# EAGLE design GasSensorCentral_v1.1 (EAGLE 7.2.0)
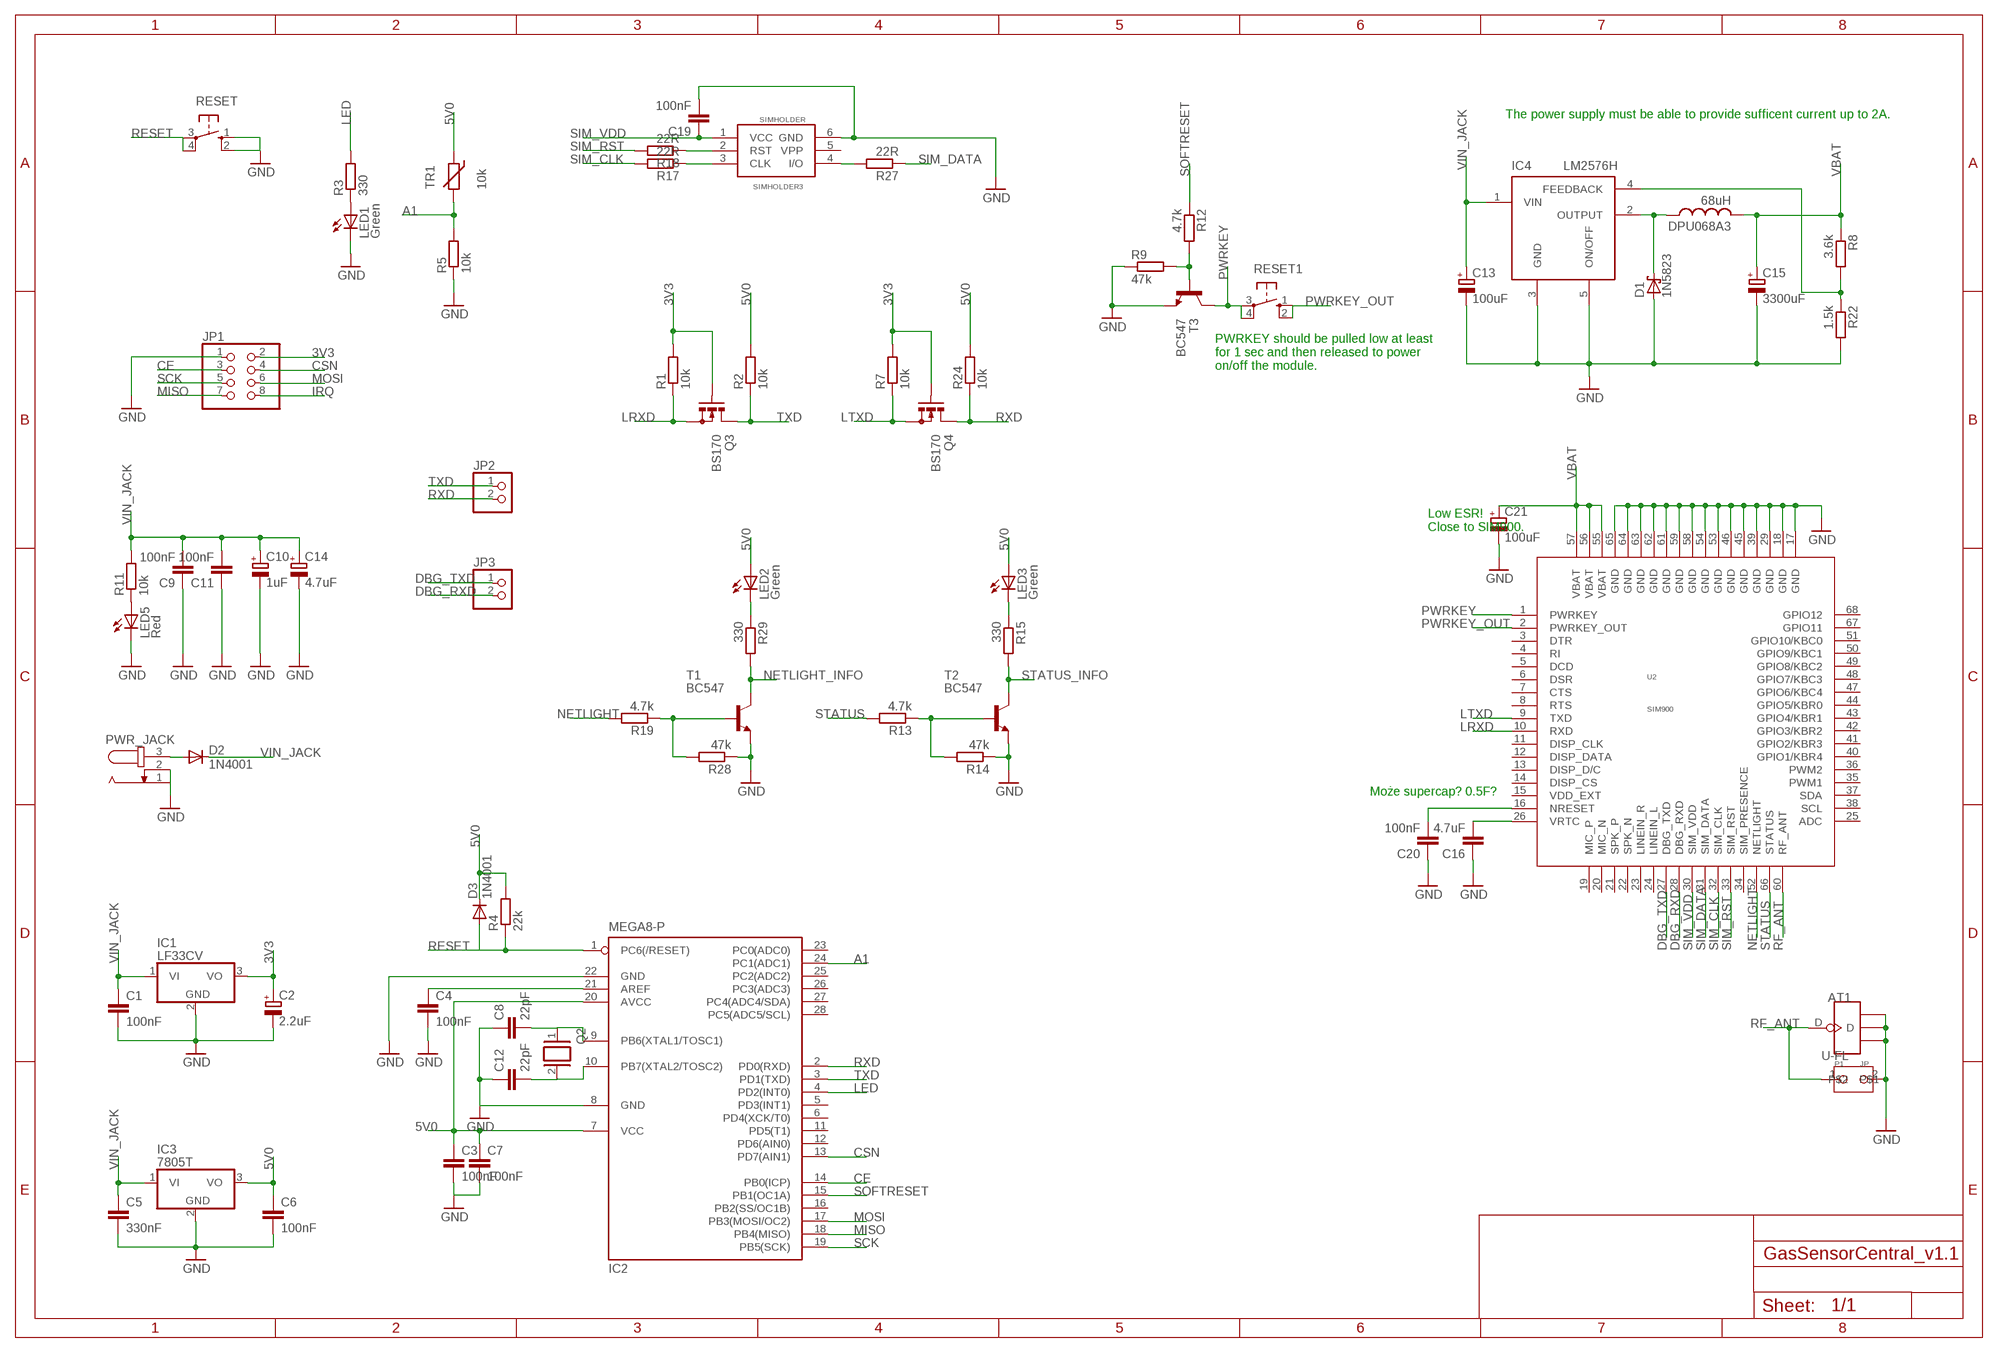
[diagram p0: schematic, sheet 1]

## Parts
AT1  U-FL  ANTENNA-U-FL  [4P-U-FL]
C1  100nF  C-EU025-025X050  [C025-025X050]
C2  2.2uF  CPOL-EUE2.5-5  [E2,5-5]
C3  100nF  C-EU025-025X050  [C025-025X050]
C4  100nF  C-EU025-025X050  [C025-025X050]
C5  330nF  C-EU025-025X050  [C025-025X050]
C6  100nF  C-EU025-025X050  [C025-025X050]
C7  100nF  C-EU025-025X050  [C025-025X050]
C8  22pF  C-EU025-025X050  [C025-025X050]
C9  100nF  C-EU025-025X050  [C025-025X050]
C10  1uF  CPOL-EUE2.5-5  [E2,5-5]
C11  100nF  C-EU025-025X050  [C025-025X050]
C12  22pF  C-EU025-025X050  [C025-025X050]
C13  100uF  CPOL-EUE2.5-5  [E2,5-5]
C14  4.7uF  CPOL-EUE2.5-5  [E2,5-5]
C15  3300uF  CPOL-EUE3.5-10  [E3,5-10]
C16  4.7uF  C-EU025-025X050  [C025-025X050]
C19  100nF  C-EU025-025X050  [C025-025X050]
C20  100nF  C-EU025-025X050  [C025-025X050]
C21  100uF  CPOL-EUE2.5-5  [E2,5-5]
D1  1N5823  1N5817-B  [DO41-7.6]
D2  1N4001  1N4004  [DO41-10]
D3  1N4001  1N4004  [DO41-10]
DPU068A3  68uH  L-USTJ3-U1  [TJ3-U1]
IC1  LF33CV  7805T  [TO220H]
IC2  MEGA8-P  [DIL28-3]
IC3  7805T  [TO220H]
IC4  LM2576H  [TO220-52]
JP1  PINHD-2X4  [2X04]
JP2  PINHD-1X2  [1X02]
JP3  PINHD-1X2  [1X02]
LED1  Green  LED3MM  [LED3MM]
LED2  Green  LED3MM  [LED3MM]
LED3  Green  LED3MM  [LED3MM]
LED5  Red  LED3MM  [LED3MM]
P1  JP  [JP]
PWR_JACK  JACK-PLUG0  [SPC4077]
Q2  XTAL/S  [QS]
Q3  BS170  [SOT54E]
Q4  BS170  [SOT54E]
R1  10k  R-EU_0207/10  [0207/10]
R2  10k  R-EU_0207/10  [0207/10]
R3  330  R-EU_0207/10  [0207/10]
R4  22k  R-EU_0207/10  [0207/10]
R5  10k  R-EU_0207/10  [0207/10]
R7  10k  R-EU_0207/10  [0207/10]
R8  3.6k  R-EU_0207/10  [0207/10]
R9  47k  R-EU_0207/10  [0207/10]
R11  10k  R-EU_0207/10  [0207/10]
R12  4.7k  R-EU_0207/10  [0207/10]
R13  4.7k  R-EU_0207/10  [0207/10]
R14  47k  R-EU_0207/10  [0207/10]
R15  330  R-EU_0207/10  [0207/10]
R17  22R  R-EU_0207/10  [0207/10]
R18  22R  R-EU_0207/10  [0207/10]
R19  4.7k  R-EU_0207/10  [0207/10]
R22  1.5k  R-EU_0207/10  [0207/10]
R24  10k  R-EU_0207/10  [0207/10]
R27  22R  R-EU_0207/10  [0207/10]
R28  47k  R-EU_0207/10  [0207/10]
R29  330  R-EU_0207/10  [0207/10]
RESET  10-XX  [B3F-10XX]
RESET1  10-XX  [B3F-10XX]
SIMHOLDER  SIMHOLDER3  [SIMHOLDER3]
T1  BC547  [TO92]
T2  BC547  [TO92]
T3  BC547  [TO92]
TR1  10k  THERMISTOR_R-2,5  [RS-2,5]
U2  SIM900  [SIM900]

## Nets
3V3: C2.+ IC1.3(VO) JP1.2 Q3.G Q4.G R1.2 R7.2
5V0: C3.1 C6.1 C7.1 D3.C IC2.7(VCC) IC2.20(AVCC) IC3.3(VO) LED2.A LED3.A R2.2 R4.2 R24.2 TR1.1
A1: IC2.24(PC1(ADC1)) R5.2 TR1.2
CE: IC2.14(PB0(ICP)) JP1.3
CSN: IC2.13(PD7(AIN1)) JP1.4
DBG_RXD: JP3.2 U2.28(DBG_RXD)
DBG_TXD: JP3.1 U2.27(DBG_TXD)
GND: AT1.GND1 AT1.GND2 AT1.GND3 C1.2 C2.- C3.2 C4.2 C5.2 C6.2 C7.2 C8.1 C9.1 C10.- C11.1 C12.1 C13.- C14.- C15.- C16.1 C19.2 C20.1 C21.- D1.A IC1.2(GND) IC2.8(GND) IC2.22(GND) IC3.2(GND) IC4.3(GND) IC4.5(ON/OFF) JP1.1 LED1.K(C) LED5.K(C) P1.2 PWR_JACK.1 PWR_JACK.2 R5.1 R9.1 R14.1 R22.2 R28.1 RESET.1(S) RESET.2(S1) SIMHOLDER.6(GND) T1.1(E) T2.1(E) T3.1(E) U2.17(GND) U2.18(GND) U2.29(GND) U2.39(GND) U2.45(GND) U2.46(GND) U2.53(GND) U2.54(GND) U2.58(GND) U2.59(GND) U2.61(GND) U2.62(GND) U2.63(GND) U2.64(GND) U2.65(GND)
IRQ: JP1.8
LED: IC2.4(PD2(INT0)) R3.2
LRXD: Q3.S R1.1 U2.10(RXD)
LTXD: Q4.S R7.1 U2.9(TXD)
MISO: IC2.18(PB4(MISO)) JP1.7
MOSI: IC2.17(PB3(MOSI/OC2)) JP1.6
N$1: C4.1 IC2.21(AREF)
N$3: IC4.4(FEEDBACK) R8.2 R22.1
N$4: D2.A PWR_JACK.3
N$5: LED1.A R3.1
N$6: R27.2 SIMHOLDER.4(I/O)
N$7: LED2.K(C) R29.1
N$9: R13.1 R14.2 T2.2(B)
N$10: LED5.A R11.1
N$11: LED3.K(C) R15.1
N$12: D1.C DPU068A3.1 IC4.2(OUTPUT)
N$13: C20.2 U2.16(NRESET)
N$14: R9.2 R12.2 T3.2(B)
N$15: R19.1 R28.2 T1.2(B)
N$17: C16.2 U2.26(VRTC)
N$24: R18.1 SIMHOLDER.2(RST)
N$25: R17.1 SIMHOLDER.3(CLK)
N$29: C8.2 IC2.9(PB6(XTAL1/TOSC1)) Q2.1
N$35: C12.2 IC2.10(PB7(XTAL2/TOSC2)) Q2.2
NETLIGHT: R19.2 U2.52(NETLIGHT)
NETLIGHT_INFO: R29.2 T1.3(C)
PWRKEY: RESET1.3(P) RESET1.4(P1) T3.3(C) U2.1(PWRKEY)
PWRKEY_OUT: RESET1.1(S) RESET1.2(S1) U2.2(PWRKEY_OUT)
RESET: D3.A IC2.1(PC6(/RESET)) R4.1 RESET.3(P) RESET.4(P1)
RF_ANT: AT1.D P1.1 U2.60(RF_ANT)
RXD: IC2.2(PD0(RXD)) JP2.2 Q4.D R24.1
SCK: IC2.19(PB5(SCK)) JP1.5
SIM_CLK: R17.2 U2.32(SIM_CLK)
SIM_DATA: R27.1 U2.31(SIM_DATA)
SIM_RST: R18.2 U2.33(SIM_RST)
SIM_VDD: C19.1 SIMHOLDER.1(VCC) U2.30(SIM_VDD)
SOFTRESET: IC2.15(PB1(OC1A)) R12.1
STATUS: R13.2 U2.66(STATUS)
STATUS_INFO: R15.2 T2.3(C)
TXD: IC2.3(PD1(TXD)) JP2.1 Q3.D R2.1
VBAT: C15.+ C21.+ DPU068A3.2 R8.1 U2.55(VBAT) U2.56(VBAT) U2.57(VBAT)
VIN_JACK: C1.1 C5.1 C9.2 C10.+ C11.2 C13.+ C14.+ D2.C IC1.1(VI) IC3.1(VI) IC4.1(VIN) R11.2
Unconnected: IC2.5(PD3(INT1)) IC2.6(PD4(XCK/T0)) IC2.11(PD5(T1)) IC2.12(PD6(AIN0)) IC2.16(PB2(SS/OC1B)) IC2.23(PC0(ADC0)) IC2.25(PC2(ADC2)) IC2.26(PC3(ADC3)) IC2.27(PC4(ADC4/SDA)) IC2.28(PC5(ADC5/SCL)) SIMHOLDER.5(VPP) U2.3(DTR) U2.4(RI) U2.5(DCD) U2.6(DSR) U2.7(CTS) U2.8(RTS) U2.11(DISP_CLK) U2.12(DISP_DATA) U2.13(DISP_D/C) U2.14(DISP_CS) U2.15(VDD_EXT) U2.19(MIC_P) U2.20(MIC_N) U2.21(SPK_P) U2.22(SPK_N) U2.23(LINEIN_R) U2.24(LINEIN_L) U2.25(ADC) U2.34(SIM_PRESENCE) U2.35(PWM1) U2.36(PWM2) U2.37(SDA) U2.38(SCL) U2.40(GPIO1/KBR4) U2.41(GPIO2/KBR3) U2.42(GPIO3/KBR2) U2.43(GPIO4/KBR1) U2.44(GPIO5/KBR0) U2.47(GPIO6/KBC4) U2.48(GPIO7/KBC3) U2.49(GPIO8/KBC2) U2.50(GPIO9/KBC1) U2.51(GPIO10/KBC0) U2.67(GPIO11) U2.68(GPIO12)

## Notes on the sheet
- The power supply must be able to provide sufficent current up to 2A.
- PWRKEY should be pulled low at least 
  for 1 sec and then released to power 
  on/off the module.
- Low ESR!
  Close to SIM900.
- Może supercap? 0.5F?

## Library data of the parts
AT1 = Connector:ANTENNA-U-FL
C1 C3-C9 C11 C12 C16 C19 C20 = rcl:C-EU: CAPACITOR, European symbol
C2 C10 C13-C15 C21 = rcl:CPOL-EU: POLARIZED CAPACITOR, European symbol
D1 = diode:1N581*: 1.0A SCHOTTKY BARRIER RECTIFIER Source: http://www.diodes.com/datasheets/ds23001.pdf
D2 D3 = diode:1N4004: DIODE general purpose rectifier, 1 A
DPU068A3 = rcl:L-US: INDUCTOR, American symbol
IC1 IC3 = linear:78*: Positive VOLTAGE REGULATOR Source: http://cache.national.com/ds/LM/LM78L05.pdf http://www.fairchildsemi.com/ds/LM/LM7805.pdf
IC2 = atmel:MEGA8-P: MICROCONTROLLER 8 Kbytes FLASH, 1 kbytes SRAM, 512 bytes EEPROM, USART, 4-channel 10 bit ADC, 2-channel 8 bit ADC Pin compatible with Atmega48, ATMega88, ATMega168 Source: avr.lbr; OC_FARNELL: unknown; OC_NEWARK: unknown
IC4 = hosho:LM2576H
JP1 = pinhead:PINHD-2X4: PIN HEADER
JP2 JP3 = pinhead:PINHD-1X2: PIN HEADER
LED1-LED3 LED5 = led:LED: LED OSRAM: - CHIPLED LG R971, LG N971, LY N971, LG Q971, LY Q971, LO R971, LY R971 LH N974, LH R974 LS Q976, LO Q976, LY Q976 LO Q996 - Hyper CHIPLED LW Q18S LB Q993, LB Q99A, LB R99A - SideLED LS A670, LO A670, LY A670, LG A670, LP A670 LB A673, LV A673, LT A673, LW A673 LH A674 LY A675 LS A676, LA A676, LO A676, LY A676, LW A676 LS A679, LY A679, LG A679 - Hyper Micro SIDELED® LS Y876, LA Y876, LO Y876, LY Y876 LT Y87S - SmartLED LW L88C, LW L88S LB L89C, LB L89S, LG L890 LS L89K, LO L89K, LY L89K LS L896, LA L896, LO L896, LY L896 - TOPLED LS T670, LO T670, LY T670, LG T670, LP T670 LSG T670, LSP T670, LSY T670, LOP T670, LYG T670 LG T671, LOG T671, LSG T671 LB T673, LV T673, LT T673, LW T673 LH T674 LS T676, LA T676, LO T676, LY T676, LB T676, LH T676, LSB T676, LW T676 LB T67C, LV T67C, LT T67C, LS T67K, LO T67K, LY T67K, LW E67C LS E67B, LA E67B, LO E67B, LY E67B, LB E67C, LV E67C, LT E67C LW T67C LS T679, LY T679, LG T679 LS T770, LO T770, LY T770, LG T770, LP T770 LB T773, LV T773, LT T773, LW T773 LH T774 LS E675, LA E675, LY E675, LS T675 LS T776, LA T776, LO T776, LY T776, LB T776 LHGB T686 LT T68C, LB T68C - Hyper Mini TOPLED® LB M676 - Mini TOPLED Santana® LG M470 LS M47K, LO M47K, LY M47K Source: http://www.osram.convergy.de LUXEON: - LUMILED® LXK2-PW12-R00, LXK2-PW12-S00, LXK2-PW14-U00, LXK2-PW14-V00 LXK2-PM12-R00, LXK2-PM12-S00, LXK2-PM14-U00 LXK2-PE12-Q00, LXK2-PE12-R00, LXK2-PE12-S00, LXK2-PE14-T00, LXK2-PE14-U00 LXK2-PB12-K00, LXK2-PB12-L00, LXK2-PB12-M00, LXK2-PB14-N00, LXK2-PB14-P00, LXK2-PB14-Q00 LXK2-PR12-L00, LXK2-PR12-M00, LXK2-PR14-Q00, LXK2-PR14-R00 LXK2-PD12-Q00, LXK2-PD12-R00, LXK2-PD12-S00 LXK2-PH12-R00, LXK2-PH12-S00 LXK2-PL12-P00, LXK2-PL12-Q00, LXK2-PL12-R00 Source: www.luxeon.com KINGBRIGHT: KA-3528ASYC Source: www.kingbright.com
P1 = mySeeed:JP
PWR_JACK = con-jack:JACK-PLUG: DC POWER JACK Power Jack, DC, Right Angle, Through Hole, Rated 5A at 16VDC, PC Terminals Distributor: Farnell (www.Farnell.de) Drawing: 84N1161.pdf / 84N1162.pdf Manufacturer: SPC Technology (www.spctechnology.com) Type: SPC4077 / SPC 4078; OC_FARNELL: unknown; OC_NEWARK: unknown
Q2 = special:XTAL/S: CRYSTAL
Q3 Q4 = transistor-small-signal:BS170: N-CHANNEL MOS FET
R1-R5 R7-R9 R11-R15 R17-R19 R22 R24 R27-R29 = rcl:R-EU_: RESISTOR, European symbol
RESET RESET1 = switch-omron:10-XX: OMRON SWITCH; MPN: B3F-1000; OC_FARNELL: 176432; OC_NEWARK: 36M3542
SIMHOLDER = SparkFun2:SIMHOLDER3
T1-T3 = transistor:BC547: NPN TRANSISTOR
TR1 = discrete:THERMISTOR_: Thermo Resistor
U2 = ICs_v54:SIM900

## Board
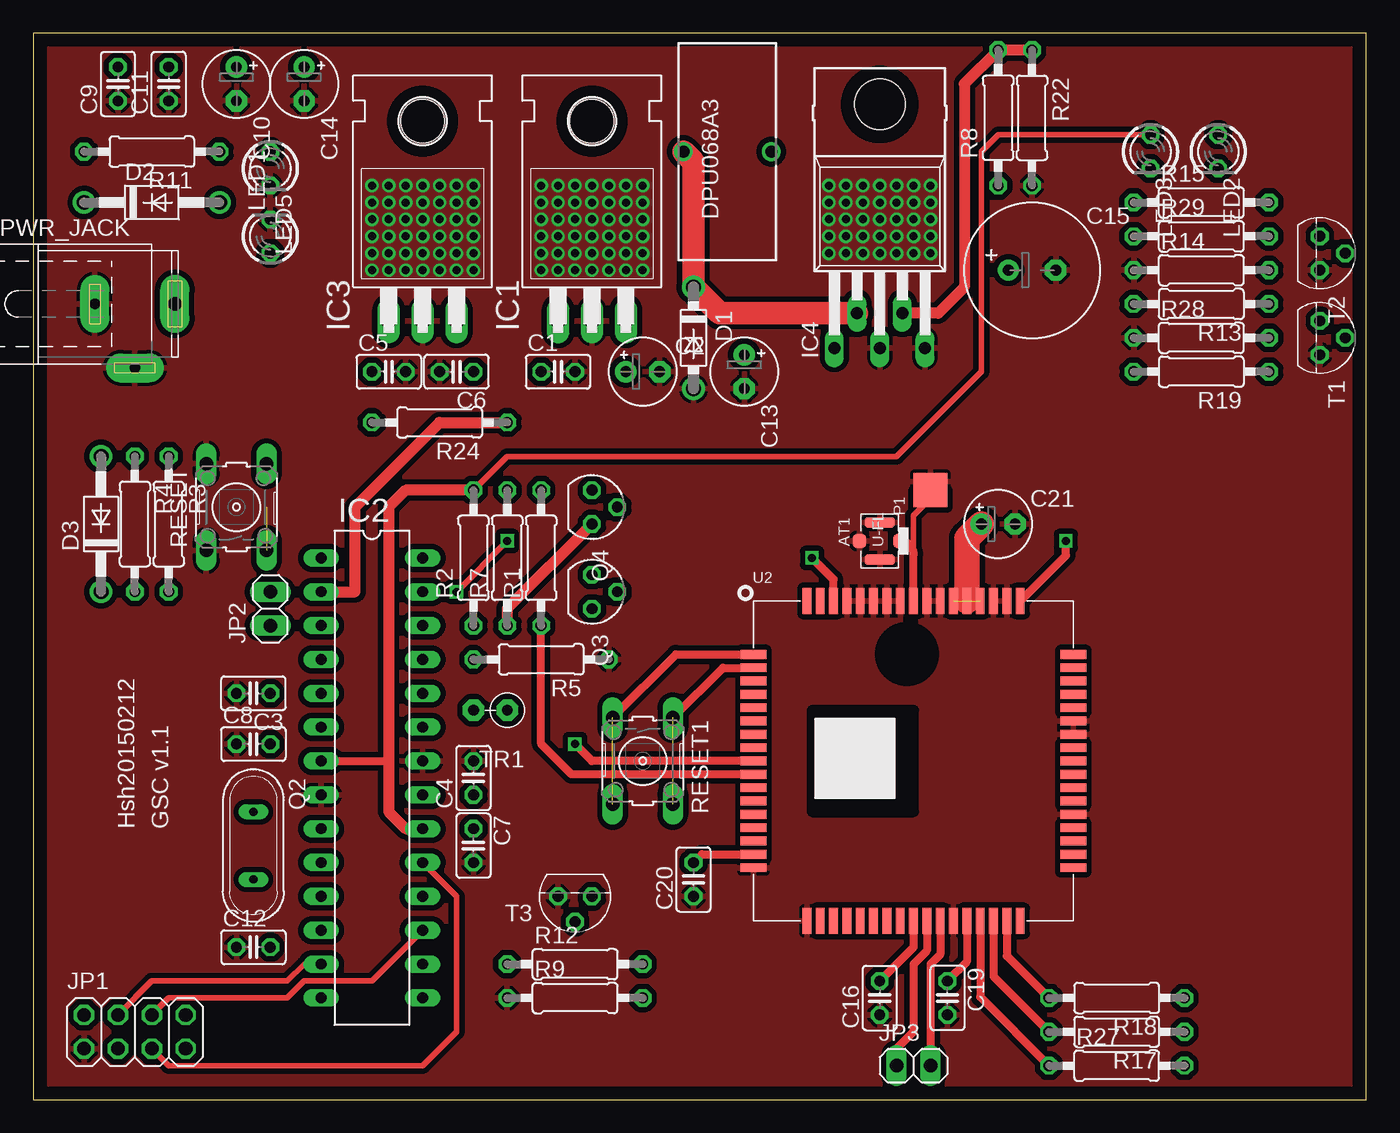
[diagram p1: board, top side]
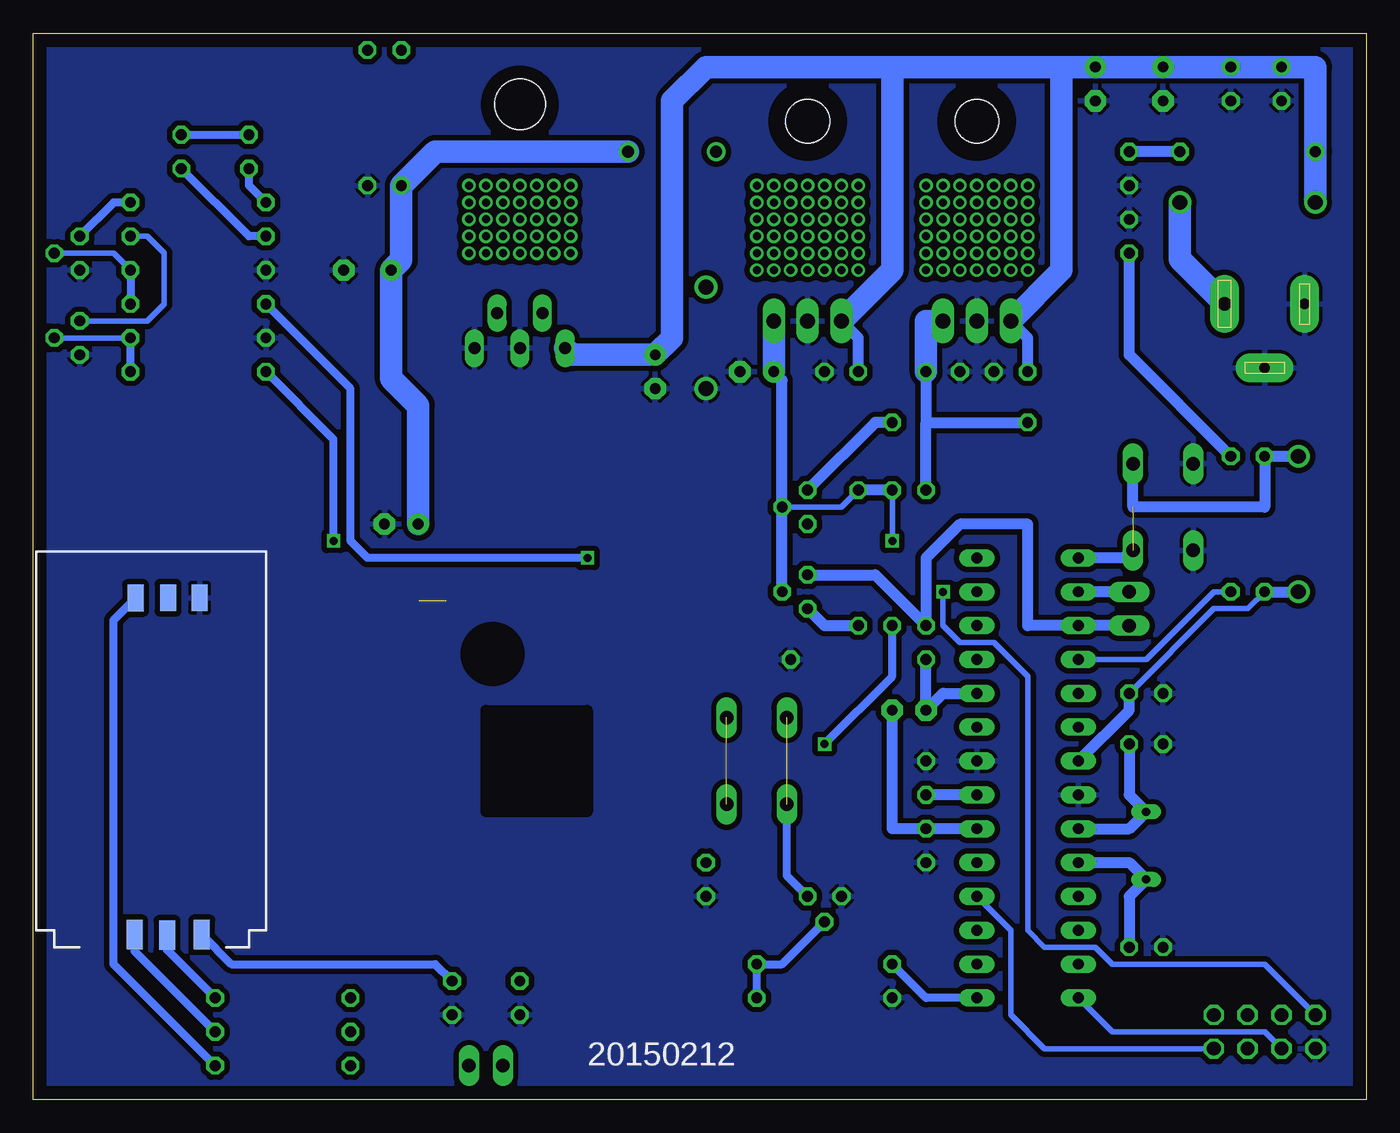
[diagram p2: board, bottom side, seen from below]

Size 100 x 80 mm. Coordinates in mm from the lower left corner, seen from the top.
Outline: 0,0 100,0 100,80 0,80 0,0
Copper layers (1*16): Top 0.035mm / dielectric 1.5mm / Bottom 0.035mm
Design rules "default": minimum track width 10mil, minimum drill 24mil, track to track 8mil, track to pad 8mil, pad to pad 8mil, via to via 8mil, smd to smd 8mil, copper to edge 40mil, drill to drill 8mil, minimum pad ring 10mil, minimum via ring 8mil, stop-mask expansion 4mil, vias tented up to drill 0mil, thermal gap 10mil
tRestrict: area 58.4,21.6 to 66,29.2; area 63.7,31.6 to 67.3,35.2
bRestrict: area 58.4,21.6 to 66,29.2; area 63.7,31.6 to 67.3,35.2

### Footprints (pad centres in the part's own frame; a part is rotated, then mirrored left to right if it is on the bottom)
4P-U-FL = smd 1.016 x 1.016: D -1.524,0; GND3 1.524,0 | smd 2.286 x 0.762: GND1 0,1.397; GND2 0,-1.397
C025-025X050 = drill 0.813 octagon: 1 -1.27,0; 2 1.27,0
E2,5-5 = drill 0.813 pad 1.6: + -1.27,0 | drill 0.813 pad 1.6 octagon: - 1.27,0
E3,5-10 = drill 0.813 pad 1.6: + -1.778,0 | drill 0.813 pad 1.6 octagon: - 1.778,0
DO41-7.6 = drill 1.1 pad 1.7: A 3.81,0; C -3.81,0
DO41-10 = drill 1.118: A 5.08,0; C -5.08,0
TJ3-U1 = drill 0.9: 1 -3.3,0; 2 3.3,0
TO220H = drill 1.118 long: 1 -2.54,-10.16; 2 0,-10.16; 3 2.54,-10.16 | hole 3.302: 0,4.826
DIL28-3 = drill 0.813 long: 1 -16.51,-3.81; 2 -13.97,-3.81; 3 -11.43,-3.81; 4 -8.89,-3.81; 5 -6.35,-3.81; 6 -3.81,-3.81; 7 -1.27,-3.81; 8 1.27,-3.81; 9 3.81,-3.81; 10 6.35,-3.81; 11 8.89,-3.81; 12 11.43,-3.81; 13 13.97,-3.81; 14 16.51,-3.81; 15 16.51,3.81; 16 13.97,3.81; 17 11.43,3.81; 18 8.89,3.81; 19 6.35,3.81; 20 3.81,3.81; 21 1.27,3.81; 22 -1.27,3.81; 23 -3.81,3.81; 24 -6.35,3.81; 25 -8.89,3.81; 26 -11.43,3.81; 27 -13.97,3.81; 28 -16.51,3.81
TO220-52 = drill 0.9 long: 1 -3.4,-21.1; 2 -1.7,-18.47; 3 0,-21.1; 4 1.7,-18.47; 5 3.4,-21.1 | hole 3.8: 0,-2.8
2X04 = drill 1.016 octagon: 1 -3.81,-1.27; 2 -3.81,1.27; 3 -1.27,-1.27; 4 -1.27,1.27; 5 1.27,-1.27; 6 1.27,1.27; 7 3.81,-1.27; 8 3.81,1.27
1X02 = drill 1.016 long: 1 -1.27,0; 2 1.27,0
LED3MM = drill 0.813 octagon: A -1.27,0; K 1.27,0
JP = smd 1.27 x 2.54: 1 -0.635,0; 2 0.635,0
SPC4077 = drill 0.8 pad 2.184 long: 1 -3,0; 2 0,-4.8 | drill 1 pad 2.184 long: 3 3,0
QS = drill 0.61 long: 1 -2.54,0; 2 2.54,0
SOT54E = drill 0.813 octagon: D -1.27,0; G 0,1.905; S 1.27,0
0207/10 = drill 0.813 octagon: 1 -5.08,0; 2 5.08,0
B3F-10XX = drill 1.016 long: 1 -3.251,2.261; 2 3.251,2.261; 3 -3.251,-2.261; 4 3.251,-2.261
SIMHOLDER3 = smd 2.2 x 1.2: 1 0.95,4.81; 2 0.91,7.41; 3 0.95,9.86 | smd 2 x 1.2: 4 26.2,9.78; 5 26.22,7.34; 6 26.22,4.98
TO92 = drill 0.813 octagon: 1 1.27,0; 2 0,1.905; 3 -1.27,0
RS-2,5 = drill 0.813 pad 1.6 octagon: 1 -1.27,0; 2 1.27,0
SIM900 = smd 1.93 x 0.66: 1 -12,8; 2 -12,7; 3 -12,6; 4 -12,5; 5 -12,4; 6 -12,3; 7 -12,2; 8 -12,1; 9 -12,0; 10 -12,-1; 11 -12,-2; 12 -12,-3; 13 -12,-4; 14 -12,-5; 15 -12,-6; 16 -12,-7; 17 -12,-8; 35 12,-8; 36 12,-7; 37 12,-6; 38 12,-5; 39 12,-4; 40 12,-3; 41 12,-2; 42 12,-1; 43 12,0; 44 12,1; 45 12,2; 46 12,3; 47 12,4; 48 12,5; 49 12,6; 50 12,7; 51 12,8 | smd 0.66 x 1.93: 18 -8,-12; 19 -7,-12; 20 -6,-12; 21 -5,-12; 22 -4,-12; 23 -3,-12; 24 -2,-12; 25 -1,-12; 26 0,-12; 27 1,-12; 28 2,-12; 29 3,-12; 30 4,-12; 31 5,-12; 32 6,-12; 33 7,-12; 34 8,-12; 52 8,12; 53 7,12; 54 6,12; 55 5,12; 56 4,12; 57 3,12; 58 2,12; 59 1,12; 60 0,12; 61 -1,12; 62 -2,12; 63 -3,12; 64 -4,12; 65 -5,12; 66 -6,12; 67 -7,12; 68 -8,12

### Placement (x,y rotation side)
AT1  63.5,41.91 180 top
C1  39.37,54.61 0 top
C2  45.72,54.61 0 top
C3  16.51,30.48 180 top
C4  33.02,24.13 90 top
C5  26.67,54.61 0 top
C6  31.75,54.61 180 top
C7  33.02,19.05 270 top
C8  16.51,26.67 0 top
C9  6.35,76.2 90 top
C10  15.24,76.2 270 top
C11  10.16,76.2 90 top
C12  16.51,11.43 0 top
C13  53.34,54.61 270 top
C14  20.32,76.2 270 top
C15  74.93,62.23 0 top
C16  63.5,7.62 90 top
C19  68.58,7.62 270 top
C20  49.53,16.51 90 top
C21  72.39,43.18 0 top
D1  49.53,57.15 270 top
D2  8.89,67.31 0 top
D3  5.08,43.18 90 top
DPU068A3  52.07,71.12 0 top
IC1  41.91,68.58 0 top
IC2  25.4,24.13 270 top
IC3  29.21,68.58 0 top
IC4  63.5,77.47 0 top
JP1  7.62,5.08 0 top
JP2  17.78,36.83 90 top
JP3  66.04,2.54 0 top
LED1  17.78,64.77 90 top
LED2  88.9,71.12 270 top
LED3  83.82,71.12 270 top
LED5  17.78,69.85 270 top
P1  67.31,45.72 90 top
PWR_JACK  7.62,59.69 0 top
Q2  16.51,19.05 270 top
Q3  41.91,38.1 270 top
Q4  41.91,44.45 270 top
R1  38.1,40.64 90 top
R2  33.02,40.64 90 top
R3  10.16,43.18 270 top
R4  7.62,43.18 270 top
R5  38.1,33.02 180 top
R7  35.56,40.64 90 top
R8  72.39,73.66 90 top
R9  40.64,7.62 0 top
R11  8.89,71.12 180 top
R12  40.64,10.16 0 top
R13  87.63,59.69 180 top
R14  87.63,62.23 0 top
R15  87.63,67.31 0 top
R17  81.28,5.08 180 top
R18  81.28,7.62 180 top
R19  87.63,54.61 180 top
R22  74.93,73.66 270 top
R24  30.48,50.8 180 top
R27  81.28,2.54 0 top
R28  87.63,57.15 0 top
R29  87.63,64.77 0 top
RESET  15.24,44.45 90 top
RESET1  45.72,25.4 270 top
SIMHOLDER  82.55,11.43 90 bottom
T1  96.52,57.15 270 top
T2  96.52,63.5 270 top
T3  40.64,15.24 180 top
TR1  34.29,29.21 180 top
U2  66.04,25.4 0 top

### Tracks (layer width: path | path; a pad name or v marks a point on that pad's centre or on a via)
3V3  (via drill 0.6)
  Top 0.406: v35.56,41.91 v31.75,38.1
  Bottom 0.406: R1.2 39.37,44.45 Q4.G | JP1.2 7.62,10.16 19.05,10.16 20.32,11.43 24.13,11.43 25.4,12.7 25.4,31.75 27.94,34.29 30.48,34.29 31.75,35.56 v31.75,38.1 | R7.2 v35.56,41.91
  Bottom 0.813: R7.2 R1.2 | Q3.G Q4.G 43.81,53.98 C2.+
  Bottom 1.676: C2.+ IC1.3
5V0
  Top 0.406: LED3.A 72.39,72.39 71.12,71.12 71.12,54.61 64.77,48.26 35.56,48.26 R2.2
  Top 0.61: IC2.7 26.67,25.4
  Top 0.813: R2.2 27.94,45.72 26.67,44.45 26.67,25.4 26.67,21.59 27.94,20.32 IC2.20
  Bottom 0.406: C3.1 11.43,36.83 8.89,36.83 R4.2
  Bottom 0.61: LED2.A LED3.A
  Bottom 0.813: R4.2 D3.C | C6.1 33.02,50.8 | 33.02,50.8 R24.2 | R2.2 33.02,50.8 | IC2.20 C7.1 35.56,20.32 TR1.1 | IC2.7 17.78,29.21 C3.1
  Bottom 1.676: C6.1 33.02,58.42 IC3.3
A1
  Bottom 0.813: IC2.24 31.75,30.48 TR1.2 R5.2
CE
  Bottom 0.406: JP1.3 7.62,5.08 19.05,5.08 IC2.14
CSN
  Top 0.406: JP1.4 8.89,8.89 19.05,8.89 20.32,10.16 IC2.13
DBG_RXD
  Top 0.61: U2.28 68.04,10.89 67.31,10.16 JP3.2
DBG_TXD
  Top 0.61: U2.27 67.04,11.16 66.04,10.16 66.04,5.08 64.77,3.81 JP3.1
GND
  pour Top (isolate 0.406): 0,80.01 100.33,80.01 100.33,0 0,0
  pour Bottom (isolate 0.406): 0,80.01 100.33,80.01 100.33,0 0,0
IC1_THERMAL  (via drill 0.6)
  other vias: 38.1,68.58 39.37,68.58 40.64,68.58 41.91,68.58 43.18,68.58 44.45,68.58 45.72,68.58 45.72,67.31 45.72,66.04 45.72,64.77 45.72,63.5 45.72,62.23 44.45,62.23 43.18,62.23 41.91,62.23 40.64,62.23 39.37,62.23 38.1,62.23 38.1,63.5 38.1,64.77 38.1,66.04 38.1,67.31 39.37,67.31 40.64,67.31 41.91,67.31 43.18,67.31 44.45,67.31 44.45,66.04 44.45,64.77 44.45,63.5 43.18,63.5 41.91,63.5 40.64,63.5 39.37,63.5 39.37,64.77 39.37,66.04 40.64,66.04 41.91,66.04 43.18,66.04 43.18,64.77 41.91,64.77 40.64,64.77
  pour Top: 36.83,76.2 46.99,76.2 46.99,60.96 36.83,60.96
IC3_THERMAL  (via drill 0.6)
  other vias: 25.4,68.58 26.67,68.58 27.94,68.58 29.21,68.58 30.48,68.58 31.75,68.58 33.02,68.58 33.02,67.31 31.75,67.31 30.48,67.31 29.21,67.31 27.94,67.31 26.67,67.31 25.4,67.31 25.4,66.04 26.67,66.04 27.94,66.04 29.21,66.04 30.48,66.04 31.75,66.04 33.02,66.04 33.02,64.77 31.75,64.77 30.48,64.77 29.21,64.77 27.94,64.77 26.67,64.77 25.4,64.77 25.4,63.5 26.67,63.5 27.94,63.5 29.21,63.5 30.48,63.5 29.21,63.5 31.75,63.5 33.02,63.5 33.02,62.23 31.75,62.23 30.48,62.23 29.21,62.23 27.94,62.23 26.67,62.23 25.4,62.23
  pour Top: 24.13,76.2 34.29,76.2 34.29,60.96 24.13,60.96
IC4_THERMAL  (via drill 0.6)
  other vias: 59.69,68.58 60.96,68.58 62.23,68.58 63.5,68.58 64.77,68.58 66.04,68.58 67.31,68.58 67.31,67.31 67.31,66.04 67.31,66.04 67.31,64.77 67.31,63.5 66.04,63.5 64.77,63.5 63.5,63.5 62.23,63.5 60.96,63.5 59.69,63.5 59.69,64.77 59.69,66.04 59.69,67.31 60.96,67.31 62.23,67.31 63.5,67.31 64.77,67.31 66.04,67.31 66.04,66.04 66.04,64.77 64.77,64.77 63.5,64.77 62.23,64.77 60.96,64.77 60.96,66.04 62.23,66.04 63.5,66.04 64.77,66.04
  pour Top: 58.42,77.47 68.58,77.47 68.58,62.23 58.42,62.23
LED
  Bottom 0.406: IC2.4 16.51,33.02 11.43,38.1 R3.2
LRXD
  Top 0.61: U2.10 40.37,24.4 38.1,26.67 R1.1
  Bottom 0.813: Q3.S 40.64,35.56 R1.1
LTXD  (via drill 0.6)
  Top 0.61: U2.9 41.91,25.4 v40.64,26.67
  Top 0.813: Q4.S 35.56,36.83 R7.1
  Bottom 0.61: v40.64,26.67 35.56,31.75 R7.1
MISO
  Bottom 0.406: JP1.7 24.13,3.81 26.67,6.35 26.67,12.7 IC2.18
MOSI
  Top 0.406: JP1.6 10.16,7.62 19.05,7.62 20.32,8.89 25.4,8.89 IC2.17
N$1
  Bottom 0.813: IC2.21 C4.1
N$3
  Top 0.813: R22.1 R8.2 69.85,76.2 69.85,60.96 67.89,59 IC4.4
N$4
  Bottom 1.676: PWR_JACK.3 13.97,63.04 D2.A
N$5
  Bottom 0.813: R3.1 17.78,55.88 LED1.A
N$6
  Bottom 0.61: R27.2 93.98,10.16 93.98,35.98 SIMHOLDER.4
N$7
  Bottom 0.61: R29.1 83.82,64.77 LED2.K
N$9
  Bottom 0.406: T2.2 93.98,63.5 R14.2
  Bottom 0.61: R14.2 R13.1
N$10
  Bottom 0.813: R11.1 LED5.A
N$11
  Bottom 0.61: R15.1 83.82,68.58 LED3.K
N$12
  Top 1.676: IC4.2 51.49,59 D1.C 49.53,70.36 DPU068A3.1
N$13
  Top 0.61: C20.2 50.15,18.4 U2.16
N$14
  Bottom 0.61: R9.2 R12.2 43.81,10.16 T3.2
N$15
  Bottom 0.406: R28.2 T1.2
  Bottom 0.61: R19.1 R28.2
N$17
  Top 0.61: U2.26 66.04,11.43 C16.2
N$24
  Bottom 0.61: SIMHOLDER.2 89.96,11.22 R18.1
N$25
  Bottom 0.61: SIMHOLDER.3 92.41,11.13 R17.1
N$29
  Bottom 0.813: IC2.9 17.78,20.32 Q2.1 17.78,22.86 C8.2
N$35
  Bottom 0.813: IC2.10 17.78,17.78 Q2.2 17.78,15.24 C12.2
NETLIGHT  (via drill 0.6)
  Top 0.61: U2.52 77.47,40.83 v77.47,41.91
  Bottom 0.61: v77.47,41.91 77.47,49.53 R19.2
NETLIGHT_INFO
  Bottom 0.406: R29.2 91.44,64.77 90.17,63.5 90.17,59.69 91.44,58.42 T1.3
PWRKEY  (1 unrouted)
  Top 0.61: RESET1.3 48.21,33.4 U2.1
  Bottom 0.61: T3.3 43.46,16.79 RESET1.4
PWRKEY_OUT  (1 unrouted)
  Top 0.61: RESET1.1 51.73,32.4 U2.2
RESET  (1 unrouted)
  Bottom 0.813: D3.A R4.1 7.62,44.45 17.5,44.45 RESET.4 | RESET.3 18.21,40.64 IC2.1
RF_ANT
  Top 0.406: 66.04,40.89 66.04,43.81 P1.1
  Top 0.61: U2.60 66.04,40.89 arc90 AT1.D
RXD
  Top 0.813: IC2.2 24.13,38.1 24.13,44.45 30.48,50.8 R24.1
  Bottom 0.813: R24.1 36.83,50.8 Q4.D | JP2.2 IC2.2
SCK
  Top 0.406: JP1.5 10.16,2.54 29.21,2.54 31.75,5.08 31.75,15.24 IC2.19
SIM_CLK
  Top 0.61: U2.32 72.04,9.24 R17.2
SIM_DATA
  Top 0.61: U2.31 71.04,7.7 R27.1
SIM_RST
  Top 0.61: U2.33 73.04,10.78 R18.2
SIM_VDD
  Top 0.61: U2.30 70.04,10.35 C19.1
  Bottom 0.61: SIMHOLDER.1 85.14,10.16 69.85,10.16 C19.1
SOFTRESET
  Bottom 0.61: IC2.15 33.02,7.62 R12.1
STATUS  (via drill 0.6)
  Top 0.61: U2.66 60.04,39.02 v58.42,40.64
  Bottom 0.61: v58.42,40.64 74.93,40.64 76.2,41.91 76.2,53.34 R13.2
STATUS_INFO
  Bottom 0.61: R15.2 93.98,67.31 T2.3
TXD
  Bottom 0.813: JP2.1 IC2.3 25.4,35.56 25.4,43.18 30.48,43.18 33.02,40.64 R2.1 36.83,39.37 Q3.D
VBAT  (2 unrouted)
  Top 1.93: C21.+ 70.04,42.1 U2.56
  Bottom 1.676: DPU068A3.2 69.85,71.12 R8.1 72.39,62.99 C15.+ 73.15,54.1 71.12,52.07 C21.+
VIN_JACK
  Bottom 0.813: C5.1 25.4,57.15 IC3.1 | C1.1 38.1,57.15 IC1.1
  Bottom 1.676: D2.C R11.2 3.81,77.47 C9.2 C11.2 C10.+ C14.+ 22.86,77.47 | 22.86,77.47 35.56,77.47 | 35.56,77.47 35.56,62.23 IC1.1 | IC3.1 22.86,62.23 22.86,77.47 | 35.56,77.47 49.53,77.47 52.07,74.93 52.07,57.15 C13.+ 59.61,55.88 IC4.1

### Text on the board
tPlace: Hsh20150212 | GSC v1.1
bPlace: 20150212